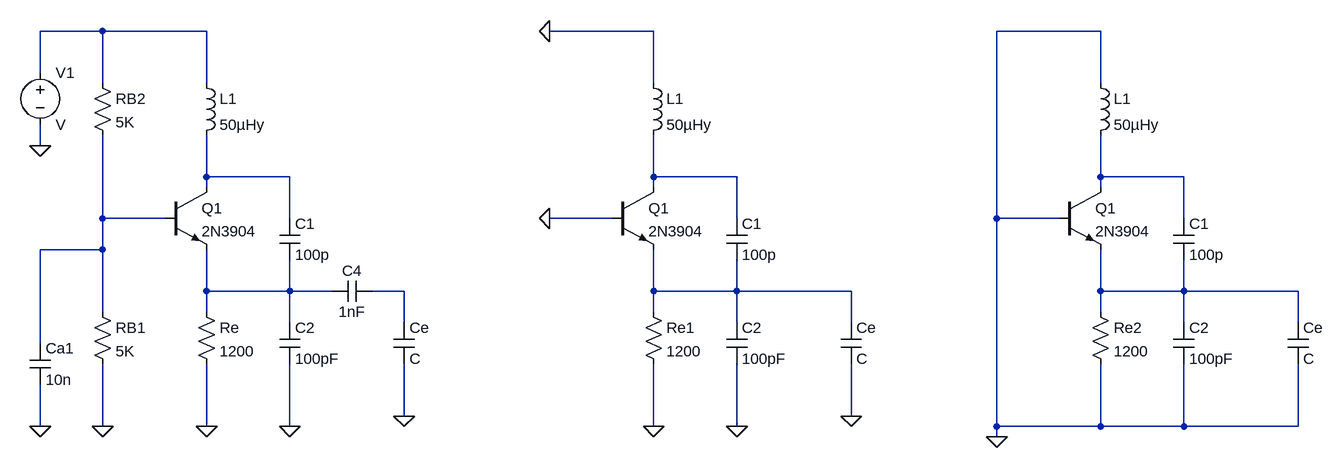
[diagram p0: schematic Collpits_a.asc]
Collpits_a.asc, the LTspice schematic file:
Version 4
SHEET 1 1832 680
WIRE -64 -304 -160 -304
WIRE 96 -304 -64 -304
WIRE 784 -304 624 -304
WIRE 1472 -304 1312 -304
WIRE -160 -240 -160 -304
WIRE -64 -224 -64 -304
WIRE 96 -224 96 -304
WIRE 784 -224 784 -304
WIRE 1472 -224 1472 -304
WIRE -160 -128 -160 -160
WIRE 96 -80 96 -144
WIRE 224 -80 96 -80
WIRE 784 -80 784 -144
WIRE 912 -80 784 -80
WIRE 1472 -80 1472 -144
WIRE 1600 -80 1472 -80
WIRE 96 -64 96 -80
WIRE 784 -64 784 -80
WIRE 1472 -64 1472 -80
WIRE -64 -16 -64 -144
WIRE 32 -16 -64 -16
WIRE 224 -16 224 -80
WIRE 720 -16 624 -16
WIRE 912 -16 912 -80
WIRE 1312 -16 1312 -304
WIRE 1408 -16 1312 -16
WIRE 1600 -16 1600 -80
WIRE -64 32 -64 -16
WIRE -64 32 -160 32
WIRE 96 96 96 32
WIRE 224 96 224 48
WIRE 224 96 96 96
WIRE 288 96 224 96
WIRE 400 96 352 96
WIRE 784 96 784 32
WIRE 912 96 912 48
WIRE 912 96 784 96
WIRE 1088 96 912 96
WIRE 1472 96 1472 32
WIRE 1600 96 1600 48
WIRE 1600 96 1472 96
WIRE 1776 96 1600 96
WIRE -64 128 -64 32
WIRE 96 128 96 96
WIRE 784 128 784 96
WIRE 1472 128 1472 96
WIRE 224 144 224 96
WIRE 400 144 400 96
WIRE 912 144 912 96
WIRE 1088 144 1088 96
WIRE 1600 144 1600 96
WIRE 1776 144 1776 96
WIRE -160 176 -160 32
WIRE 400 288 400 208
WIRE 1088 288 1088 208
WIRE -160 304 -160 240
WIRE -64 304 -64 208
WIRE 96 304 96 208
WIRE 224 304 224 208
WIRE 784 304 784 208
WIRE 912 304 912 208
WIRE 1312 304 1312 -16
WIRE 1472 304 1472 208
WIRE 1472 304 1312 304
WIRE 1600 304 1600 208
WIRE 1600 304 1472 304
WIRE 1776 304 1776 208
WIRE 1776 304 1600 304
WIRE 1312 320 1312 304
FLAG 96 304 0
FLAG -64 304 0
FLAG -160 304 0
FLAG 224 304 0
FLAG 400 288 0
FLAG -160 -128 0
FLAG 784 304 0
FLAG 912 304 0
FLAG 1088 288 0
FLAG 624 -16 0
FLAG 624 -304 0
FLAG 1312 320 0
SYMBOL ind 80 -240 R0
SYMATTR InstName L1
SYMATTR Value 50µHy
SYMBOL res 80 112 R0
SYMATTR InstName Re
SYMATTR Value 1200
SYMBOL res -80 112 R0
SYMATTR InstName RB1
SYMATTR Value 5K
SYMBOL res -80 -240 R0
SYMATTR InstName RB2
SYMATTR Value 5K
SYMBOL cap 208 144 R0
SYMATTR InstName C2
SYMATTR Value 100pF
SYMBOL cap 208 -16 R0
SYMATTR InstName C1
SYMATTR Value 100p
SYMBOL cap -176 176 R0
SYMATTR InstName Ca1
SYMATTR Value 10n
SYMBOL cap 352 80 R90
WINDOW 0 0 32 VBottom 2
WINDOW 3 32 32 VTop 2
SYMATTR InstName C4
SYMATTR Value 1nF
SYMBOL npn 32 -64 R0
SYMATTR InstName Q1
SYMATTR Value 2N3904
SYMBOL cap 384 144 R0
SYMATTR InstName Ce
SYMBOL voltage -160 -256 R0
SYMATTR InstName V1
SYMBOL ind 768 -240 R0
SYMATTR InstName L1
SYMATTR Value 50µHy
SYMBOL res 768 112 R0
SYMATTR InstName Re1
SYMATTR Value 1200
SYMBOL cap 896 144 R0
SYMATTR InstName C2
SYMATTR Value 100pF
SYMBOL cap 896 -16 R0
SYMATTR InstName C1
SYMATTR Value 100p
SYMBOL npn 720 -64 R0
SYMATTR InstName Q1
SYMATTR Value 2N3904
SYMBOL cap 1072 144 R0
SYMATTR InstName Ce
SYMBOL ind 1456 -240 R0
SYMATTR InstName L1
SYMATTR Value 50µHy
SYMBOL res 1456 112 R0
SYMATTR InstName Re2
SYMATTR Value 1200
SYMBOL cap 1584 144 R0
SYMATTR InstName C2
SYMATTR Value 100pF
SYMBOL cap 1584 -16 R0
SYMATTR InstName C1
SYMATTR Value 100p
SYMBOL npn 1408 -64 R0
SYMATTR InstName Q1
SYMATTR Value 2N3904
SYMBOL cap 1760 144 R0
SYMATTR InstName Ce

The netlist it stands for:
* Collpits_a.asc
L1 N001 N002 50µHy
Re N006 0 1200
RB1 N005 0 5K
RB2 N001 N005 5K
C2 N006 0 100pF
C1 N002 N006 100p
Ca1 N005 0 10n
C4 N007 N006 1nF
Q1 N002 N005 N006 0 2N3904
Ce N007 0 C
V1 N001 0 V
L1 0 N003 50µHy
Re1 N008 0 1200
C2 N008 0 100pF
C1 N003 N008 100p
Q1 N003 0 N008 0 2N3904
Ce N008 0 C
L1 0 N004 50µHy
Re2 N009 0 1200
C2 N009 0 100pF
C1 N004 N009 100p
Q1 N004 0 N009 0 2N3904
Ce N009 0 C
.model NPN NPN
.model PNP PNP
.lib standard.bjt
.backanno
.end